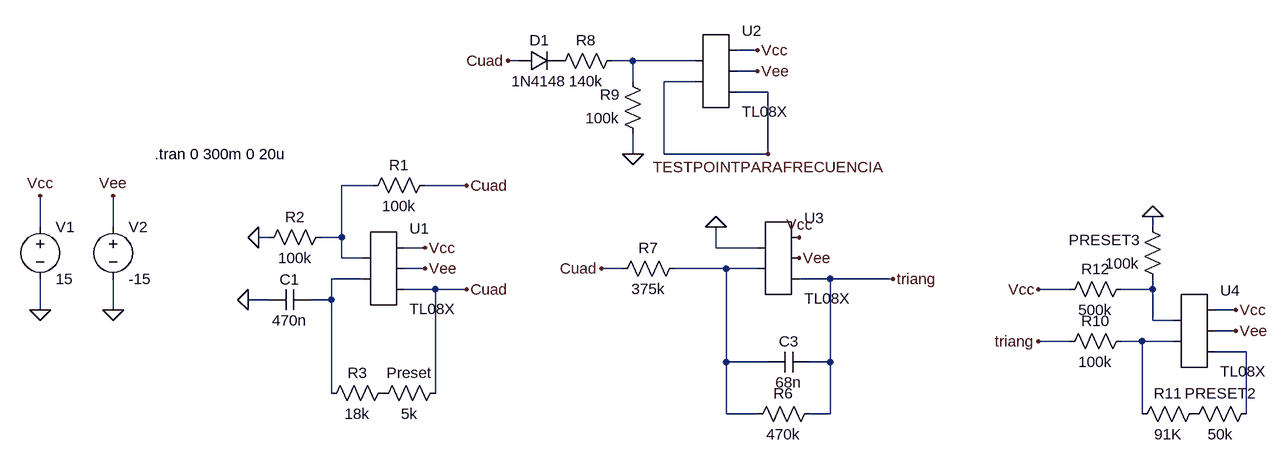
[diagram p0: schematic Draft6.asc]
Draft6.asc, the LTspice schematic file:
Version 4
SHEET 1 1868 680
WIRE 704 -80 672 -80
WIRE 336 -64 320 -64
WIRE 512 -64 480 -64
WIRE 608 -64 512 -64
WIRE 704 -48 672 -48
WIRE 512 -32 512 -64
WIRE 608 -32 560 -32
WIRE 720 -16 672 -16
WIRE 512 80 512 48
WIRE 560 80 560 -32
WIRE 720 80 720 -16
WIRE 720 80 560 80
WIRE 112 128 64 128
WIRE 256 128 192 128
WIRE -400 192 -400 144
WIRE -288 192 -288 144
WIRE 1312 192 1312 176
WIRE -48 208 -64 208
WIRE 64 208 64 128
WIRE 64 208 32 208
WIRE 192 224 160 224
WIRE 640 224 640 192
WIRE 704 224 640 224
WIRE 64 240 64 208
WIRE 96 240 64 240
WIRE 192 256 160 256
WIRE 496 256 464 256
WIRE 656 256 576 256
WIRE 704 256 656 256
WIRE 96 272 48 272
WIRE 816 272 768 272
WIRE 912 272 816 272
WIRE 208 288 160 288
WIRE 256 288 208 288
WIRE 1184 288 1136 288
WIRE 1312 288 1312 272
WIRE 1312 288 1264 288
WIRE -48 304 -80 304
WIRE 48 304 48 272
WIRE 48 304 16 304
WIRE -400 320 -400 272
WIRE -288 320 -288 272
WIRE 1440 320 1408 320
WIRE 1312 336 1312 288
WIRE 1344 336 1312 336
WIRE 1440 352 1408 352
WIRE 1184 368 1136 368
WIRE 1296 368 1264 368
WIRE 1344 368 1296 368
WIRE 1456 384 1408 384
WIRE 656 400 656 256
WIRE 720 400 656 400
WIRE 816 400 816 272
WIRE 816 400 784 400
WIRE 48 448 48 304
WIRE 208 448 208 288
WIRE 656 480 656 400
WIRE 704 480 656 480
WIRE 816 480 816 400
WIRE 816 480 784 480
WIRE 1296 480 1296 368
WIRE 1456 480 1456 384
FLAG -400 320 0
FLAG -288 320 0
FLAG -400 144 Vcc
FLAG -288 144 Vee
FLAG -80 304 0
FLAG -64 208 0
FLAG 192 224 Vcc
FLAG 192 256 Vee
FLAG 768 240 Vee
FLAG 768 208 Vcc
FLAG 640 192 0
FLAG 256 288 Cuad
FLAG 320 -64 Cuad
FLAG 512 80 0
FLAG 464 256 Cuad
FLAG 256 128 Cuad
FLAG 912 272 triang
FLAG 1136 368 triang
FLAG 1136 288 Vcc
FLAG 1312 176 0
FLAG 1440 320 Vcc
FLAG 1440 352 Vee
FLAG 704 -80 Vcc
FLAG 704 -48 Vee
FLAG 720 80 TESTPOINTPARAFRECUENCIA
SYMBOL voltage -400 176 R0
WINDOW 123 0 0 Left 0
WINDOW 39 0 0 Left 0
SYMATTR InstName V1
SYMATTR Value 15
SYMBOL voltage -288 176 R0
WINDOW 123 0 0 Left 0
WINDOW 39 0 0 Left 0
SYMATTR InstName V2
SYMATTR Value -15
SYMBOL cap -48 320 R270
WINDOW 0 32 32 VTop 2
WINDOW 3 0 32 VBottom 2
SYMATTR InstName C1
SYMATTR Value 470n
SYMBOL res 208 112 R90
WINDOW 0 0 56 VBottom 2
WINDOW 3 32 56 VTop 2
SYMATTR InstName R1
SYMATTR Value 100k
SYMBOL res 48 192 R90
WINDOW 0 0 56 VBottom 2
WINDOW 3 32 56 VTop 2
SYMATTR InstName R2
SYMATTR Value 100k
SYMBOL res 144 432 R90
WINDOW 0 0 56 VBottom 2
WINDOW 3 32 56 VTop 2
SYMATTR InstName R3
SYMATTR Value 18k
SYMBOL AutoGenerated\\TL08X 128 256 R0
SYMATTR InstName U1
SYMBOL cap 784 384 R90
WINDOW 0 0 32 VBottom 2
WINDOW 3 32 32 VTop 2
SYMATTR InstName C3
SYMATTR Value 68n
SYMBOL res 800 464 R90
WINDOW 0 0 56 VBottom 2
WINDOW 3 32 56 VTop 2
SYMATTR InstName R6
SYMATTR Value 470k
SYMBOL res 592 240 R90
WINDOW 0 0 56 VBottom 2
WINDOW 3 32 56 VTop 2
SYMATTR InstName R7
SYMATTR Value 375k
SYMBOL res 496 -80 R90
WINDOW 0 0 56 VBottom 2
WINDOW 3 32 56 VTop 2
SYMATTR InstName R8
SYMATTR Value 140k
SYMBOL res 528 64 R180
WINDOW 0 36 76 Left 2
WINDOW 3 36 40 Left 2
SYMATTR InstName R9
SYMATTR Value 100k
SYMBOL diode 336 -48 R270
WINDOW 0 32 32 VTop 2
WINDOW 3 0 32 VBottom 2
SYMATTR InstName D1
SYMATTR Value 1N4148
SYMBOL AutoGenerated\\TL08X 1376 352 R0
SYMATTR InstName U4
SYMBOL res 1280 352 R90
WINDOW 0 0 56 VBottom 2
WINDOW 3 32 56 VTop 2
SYMATTR InstName R10
SYMATTR Value 100k
SYMBOL res 1280 496 R270
WINDOW 0 32 56 VTop 2
WINDOW 3 0 56 VBottom 2
SYMATTR InstName R11
SYMATTR Value 91K
SYMBOL res 1280 272 R90
WINDOW 0 0 56 VBottom 2
WINDOW 3 32 56 VTop 2
SYMATTR InstName R12
SYMATTR Value 500k
SYMBOL res 1328 288 R180
WINDOW 0 36 76 Left 2
WINDOW 3 36 40 Left 2
SYMATTR InstName PRESET3
SYMATTR Value 100k
SYMBOL res 224 432 R90
WINDOW 0 0 56 VBottom 2
WINDOW 3 32 56 VTop 2
SYMATTR InstName Preset
SYMATTR Value 5k
SYMBOL AutoGenerated\\TL08X 640 -48 R0
SYMATTR InstName U2
SYMBOL res 1472 464 R90
WINDOW 0 0 56 VBottom 2
WINDOW 3 32 56 VTop 2
SYMATTR InstName PRESET2
SYMATTR Value 50k
SYMBOL AutoGenerated\\TL08X 736 240 R0
SYMATTR InstName U3
TEXT -224 80 Left 2 !.tran 0 300m 0 20u

The netlist it stands for:
* Draft6.asc
V1 Vcc 0 15
V2 Vee 0 -15
C1 0 N004 470n
R1 Cuad N002 100k
R2 N002 0 100k
R3 P001 N004 18k
* U1: TL08X (symbol AutoGenerated\TL08X not available, pins judged from their places): pin1=N002 pin2=N004 pin3=Vcc pin4=Vee pin5=Cuad
C3 triang N003 68n
R6 triang N003 470k
R7 N003 Cuad 375k
R8 N001 P002 140k
R9 0 N001 100k
D1 Cuad P002 1N4148
* U4: TL08X (symbol AutoGenerated\TL08X not available, pins judged from their places): pin1=N005 pin2=N006 pin3=Vcc pin4=Vee pin5=N007
R10 N006 triang 100k
R11 N006 P003 91K
R12 N005 Vcc 500k
R§PRESET3 N005 0 100k
R§Preset Cuad P001 5k
* U2: TL08X (symbol AutoGenerated\TL08X not available, pins judged from their places): pin1=N001 pin2=TESTPOINTPARAFRECUENCIA pin3=Vcc pin4=Vee pin5=TESTPOINTPARAFRECUENCIA
R§PRESET2 N007 P003 50k
* U3: TL08X (symbol AutoGenerated\TL08X not available, pins judged from their places): pin1=0 pin2=N003 pin3=Vcc pin4=Vee pin5=triang
.model D D
.lib standard.dio
.tran 0 300m 0 20u
.backanno
.end